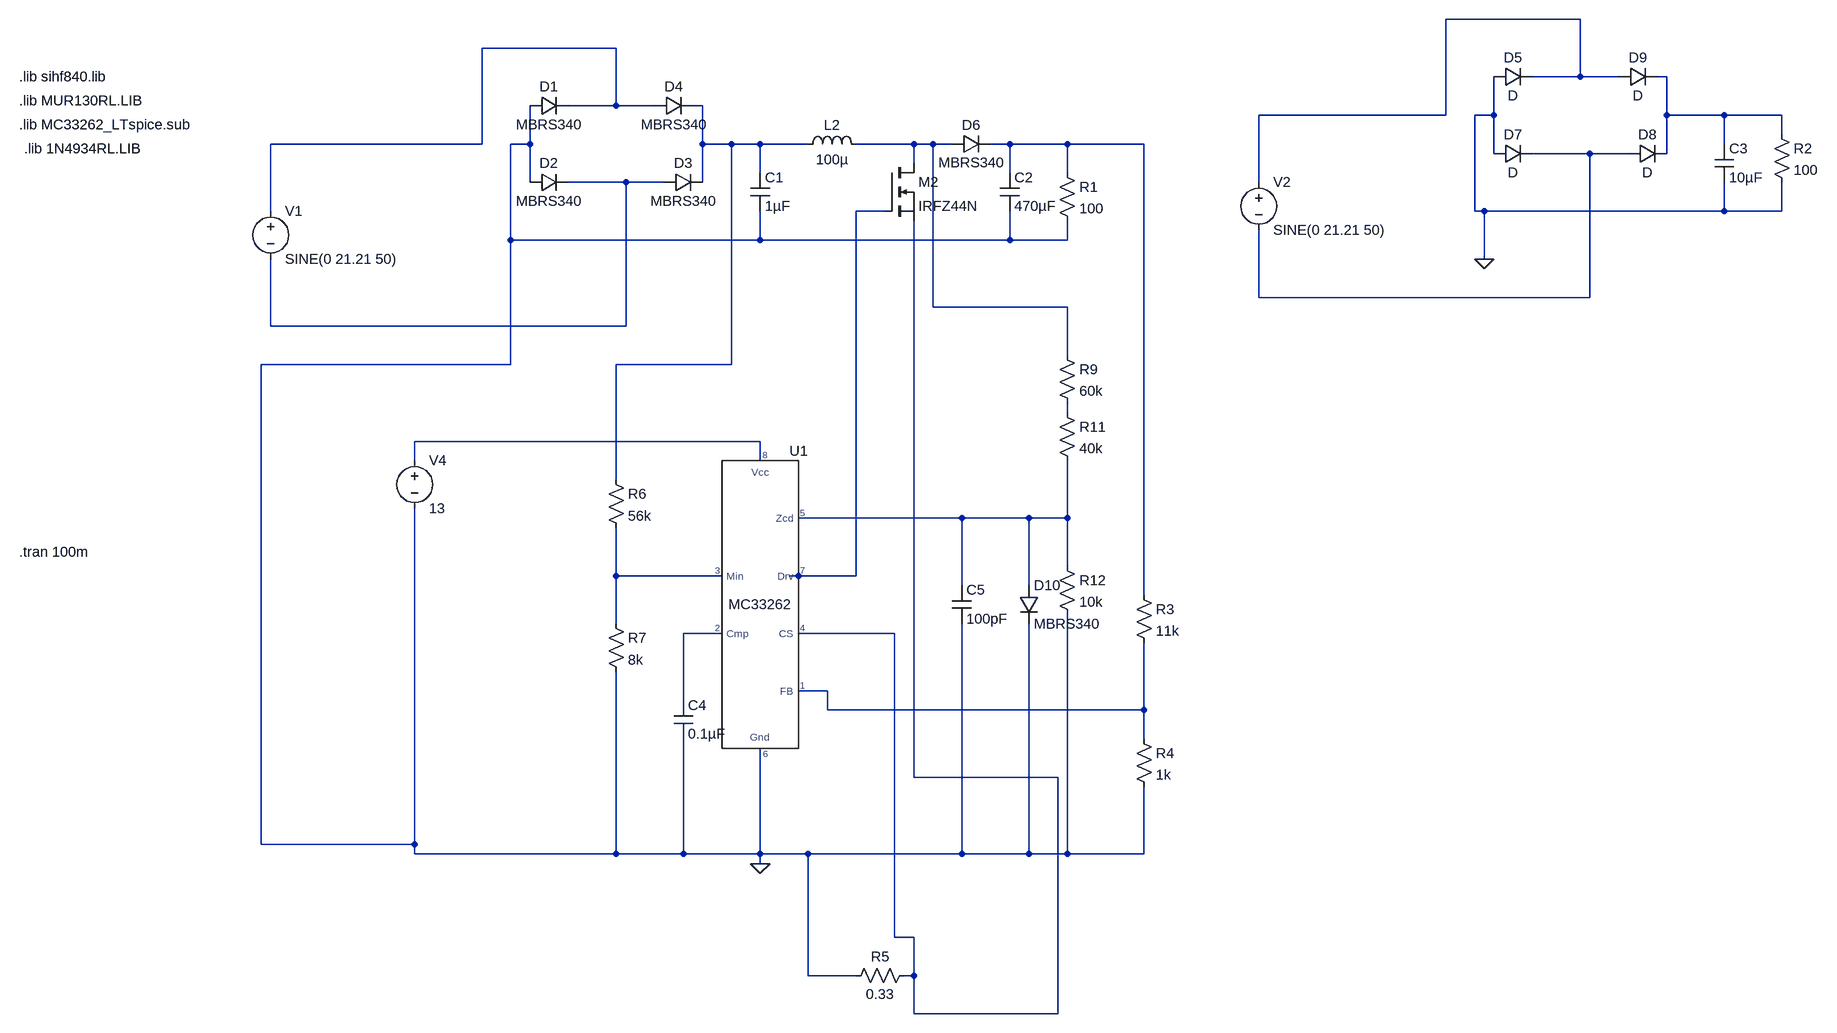
[diagram p0: schematic project_ckt.asc]
project_ckt.asc, the LTspice schematic file:
Version 4.1
SHEET 1 3764 1892
WIRE 3360 -80 3136 -80
WIRE 1296 -32 1072 -32
WIRE 3360 16 3360 -80
WIRE 3360 16 3280 16
WIRE 3424 16 3360 16
WIRE 3504 16 3488 16
WIRE 1296 64 1296 -32
WIRE 1296 64 1216 64
WIRE 1360 64 1296 64
WIRE 1440 64 1424 64
WIRE 3136 80 3136 -80
WIRE 3136 80 2784 80
WIRE 3216 80 3216 16
WIRE 3216 80 3184 80
WIRE 3504 80 3504 16
WIRE 3600 80 3504 80
WIRE 3696 80 3600 80
WIRE 3696 112 3696 80
WIRE 1072 128 1072 -32
WIRE 1072 128 720 128
WIRE 1152 128 1152 64
WIRE 1152 128 1120 128
WIRE 1440 128 1440 64
WIRE 1488 128 1440 128
WIRE 1536 128 1488 128
WIRE 1616 128 1536 128
WIRE 1792 128 1696 128
WIRE 1824 128 1792 128
WIRE 1856 128 1824 128
WIRE 1952 128 1920 128
WIRE 2048 128 1952 128
WIRE 2176 128 2048 128
WIRE 3600 128 3600 80
WIRE 3216 144 3216 80
WIRE 3376 144 3280 144
WIRE 3440 144 3376 144
WIRE 3504 144 3504 80
WIRE 1792 160 1792 128
WIRE 1536 176 1536 128
WIRE 1952 176 1952 128
WIRE 2048 176 2048 128
WIRE 1152 192 1152 128
WIRE 1312 192 1216 192
WIRE 1376 192 1312 192
WIRE 1440 192 1440 128
WIRE 2784 192 2784 80
WIRE 720 240 720 128
WIRE 1744 240 1696 240
WIRE 3184 240 3184 80
WIRE 3200 240 3184 240
WIRE 3600 240 3600 192
WIRE 3600 240 3200 240
WIRE 3696 240 3696 192
WIRE 3696 240 3600 240
WIRE 1120 288 1120 128
WIRE 1536 288 1536 240
WIRE 1536 288 1120 288
WIRE 1952 288 1952 240
WIRE 1952 288 1536 288
WIRE 2048 288 2048 256
WIRE 2048 288 1952 288
WIRE 3200 320 3200 240
WIRE 2784 384 2784 272
WIRE 3376 384 3376 144
WIRE 3376 384 2784 384
WIRE 1824 400 1824 128
WIRE 2048 400 1824 400
WIRE 720 432 720 320
WIRE 1312 432 1312 192
WIRE 1312 432 720 432
WIRE 2048 480 2048 400
WIRE 1120 496 1120 288
WIRE 1120 496 704 496
WIRE 1488 496 1488 128
WIRE 1488 496 1296 496
WIRE 2048 576 2048 560
WIRE 1536 624 960 624
WIRE 960 656 960 624
WIRE 1536 656 1536 624
WIRE 1296 688 1296 496
WIRE 1872 752 1600 752
WIRE 1984 752 1872 752
WIRE 2048 752 2048 656
WIRE 2048 752 1984 752
WIRE 2048 832 2048 752
WIRE 1296 848 1296 768
WIRE 1472 848 1296 848
WIRE 1600 848 1584 848
WIRE 1696 848 1696 240
WIRE 1696 848 1600 848
WIRE 1872 864 1872 752
WIRE 1984 864 1984 752
WIRE 2176 880 2176 128
WIRE 1296 928 1296 848
WIRE 1472 944 1408 944
WIRE 1760 944 1600 944
WIRE 1648 1040 1600 1040
WIRE 1408 1056 1408 944
WIRE 1648 1072 1648 1040
WIRE 2176 1072 2176 960
WIRE 2176 1072 1648 1072
WIRE 2176 1120 2176 1072
WIRE 1792 1184 1792 256
WIRE 2032 1184 1792 1184
WIRE 704 1296 704 496
WIRE 960 1296 960 736
WIRE 960 1296 704 1296
WIRE 960 1312 960 1296
WIRE 1296 1312 1296 1008
WIRE 1296 1312 960 1312
WIRE 1408 1312 1408 1120
WIRE 1408 1312 1296 1312
WIRE 1536 1312 1536 1136
WIRE 1536 1312 1408 1312
WIRE 1616 1312 1536 1312
WIRE 1872 1312 1872 928
WIRE 1872 1312 1616 1312
WIRE 1984 1312 1984 928
WIRE 1984 1312 1872 1312
WIRE 2048 1312 2048 912
WIRE 2048 1312 1984 1312
WIRE 2176 1312 2176 1200
WIRE 2176 1312 2048 1312
WIRE 1536 1328 1536 1312
WIRE 1760 1504 1760 944
WIRE 1792 1504 1760 1504
WIRE 1616 1568 1616 1312
WIRE 1696 1568 1616 1568
WIRE 1792 1568 1792 1504
WIRE 1792 1568 1776 1568
WIRE 1792 1632 1792 1568
WIRE 2032 1632 2032 1184
WIRE 2032 1632 1792 1632
FLAG 1536 1328 0
FLAG 3200 320 0
SYMBOL voltage 720 224 R0
WINDOW 123 0 0 Left 0
WINDOW 39 0 0 Left 0
SYMATTR InstName V1
SYMATTR Value SINE(0 21.21 50)
SYMBOL diode 1152 80 R270
WINDOW 0 32 32 VTop 2
WINDOW 3 0 32 VBottom 2
SYMATTR InstName D1
SYMATTR Value MBRS340
SYMBOL diode 1152 208 R270
WINDOW 0 32 32 VTop 2
WINDOW 3 0 32 VBottom 2
SYMATTR InstName D2
SYMATTR Value MBRS340
SYMBOL diode 1376 208 R270
WINDOW 0 32 32 VTop 2
WINDOW 3 0 32 VBottom 2
SYMATTR InstName D3
SYMATTR Value MBRS340
SYMBOL diode 1360 80 R270
WINDOW 0 32 32 VTop 2
WINDOW 3 0 32 VBottom 2
SYMATTR InstName D4
SYMATTR Value MBRS340
SYMBOL cap 1520 176 R0
SYMATTR InstName C1
SYMATTR Value 1µF
SYMBOL ind 1600 144 R270
WINDOW 0 32 56 VTop 2
WINDOW 3 5 56 VBottom 2
SYMATTR InstName L2
SYMATTR Value 100µ
SYMATTR SpiceLine Ipk=3
SYMBOL diode 1856 144 R270
WINDOW 0 32 32 VTop 2
WINDOW 3 0 32 VBottom 2
SYMATTR InstName D6
SYMATTR Value MBRS340
SYMBOL nmos 1744 160 R0
SYMATTR InstName M2
SYMATTR Value IRFZ44N
SYMBOL cap 1936 176 R0
SYMATTR InstName C2
SYMATTR Value 470µF
SYMBOL res 2032 160 R0
SYMATTR InstName R1
SYMATTR Value 100
SYMBOL MC33262 1536 896 R0
SYMATTR InstName U1
SYMBOL res 2160 864 R0
SYMATTR InstName R3
SYMATTR Value 11k
SYMBOL res 2160 1104 R0
SYMATTR InstName R4
SYMATTR Value 1k
SYMBOL res 1280 672 R0
SYMATTR InstName R6
SYMATTR Value 56k
SYMBOL res 1280 912 R0
SYMATTR InstName R7
SYMATTR Value 8k
SYMBOL res 2032 464 R0
SYMATTR InstName R9
SYMATTR Value 60k
SYMBOL res 2032 560 R0
SYMATTR InstName R11
SYMATTR Value 40k
SYMBOL res 2032 816 R0
SYMATTR InstName R12
SYMATTR Value 10k
SYMBOL voltage 960 640 R0
WINDOW 123 0 0 Left 0
WINDOW 39 0 0 Left 0
SYMATTR InstName V4
SYMATTR Value 13
SYMBOL voltage 2784 176 R0
WINDOW 123 0 0 Left 0
WINDOW 39 0 0 Left 0
SYMATTR InstName V2
SYMATTR Value SINE(0 21.21 50)
SYMBOL diode 3216 32 R270
WINDOW 0 32 32 VTop 2
WINDOW 3 0 32 VBottom 2
SYMATTR InstName D5
SYMBOL diode 3216 160 R270
WINDOW 0 32 32 VTop 2
WINDOW 3 0 32 VBottom 2
SYMATTR InstName D7
SYMBOL diode 3440 160 R270
WINDOW 0 32 32 VTop 2
WINDOW 3 0 32 VBottom 2
SYMATTR InstName D8
SYMBOL diode 3424 32 R270
WINDOW 0 32 32 VTop 2
WINDOW 3 0 32 VBottom 2
SYMATTR InstName D9
SYMBOL cap 3584 128 R0
SYMATTR InstName C3
SYMATTR Value 10µF
SYMBOL res 3680 96 R0
SYMATTR InstName R2
SYMATTR Value 100
SYMBOL cap 1392 1056 R0
SYMATTR InstName C4
SYMATTR Value 0.1µF
SYMBOL cap 1856 864 R0
SYMATTR InstName C5
SYMATTR Value 100pF
SYMBOL diode 1968 864 R0
SYMATTR InstName D10
SYMATTR Value MBRS340
SYMBOL res 1792 1552 R90
WINDOW 0 0 56 VBottom 2
WINDOW 3 32 56 VTop 2
SYMATTR InstName R5
SYMATTR Value 0.33
TEXT -16 16 Left 2 !.lib sihf840.lib
TEXT -16 56 Left 2 !.lib MUR130RL.LIB
TEXT -16 96 Left 2 !.lib MC33262_LTspice.sub
TEXT -8 136 Left 2 !.lib 1N4934RL.LIB
TEXT -16 808 Left 2 !.tran 100m

The netlist it stands for:
* project_ckt.asc
V1 N002 N008 SINE(0 21.21 50)
D1 0 N002 MBRS340
D2 0 N008 MBRS340
D3 N008 N004 MBRS340
D4 N002 N004 MBRS340
C1 N004 0 1µF
L2 N004 N005 100µ Ipk=3
D6 N005 N006 MBRS340
M2 N005 N009 N015 N015 IRFZ44N
C2 N006 0 470µF
R1 N006 0 100
X§U1 N016 N014 N013 N015 N012 0 N009 N011 MC33262  ; pins FB Cmp Min CS Zcd Gnd Drv Vcc
R3 N006 N016 11k
R4 N016 0 1k
R6 N004 N013 56k
R7 N013 0 8k
R9 N005 N010 60k
R11 N010 N012 40k
R12 N012 0 10k
V4 N011 0 13
V2 N001 N007 SINE(0 21.21 50)
D5 0 N001 D
D7 0 N007 D
D8 N007 N003 D
D9 N001 N003 D
C3 N003 0 10µF
R2 N003 0 100
C4 N014 0 0.1µF
C5 N012 0 100pF
D10 N012 0 MBRS340
R5 N015 0 0.33
.model D D
.lib standard.dio
.model NMOS NMOS
.model PMOS PMOS
.lib standard.mos
.lib sihf840.lib
.lib MUR130RL.LIB
.lib MC33262_LTspice.sub
.lib 1N4934RL.LIB
.tran 100m
.backanno
.end